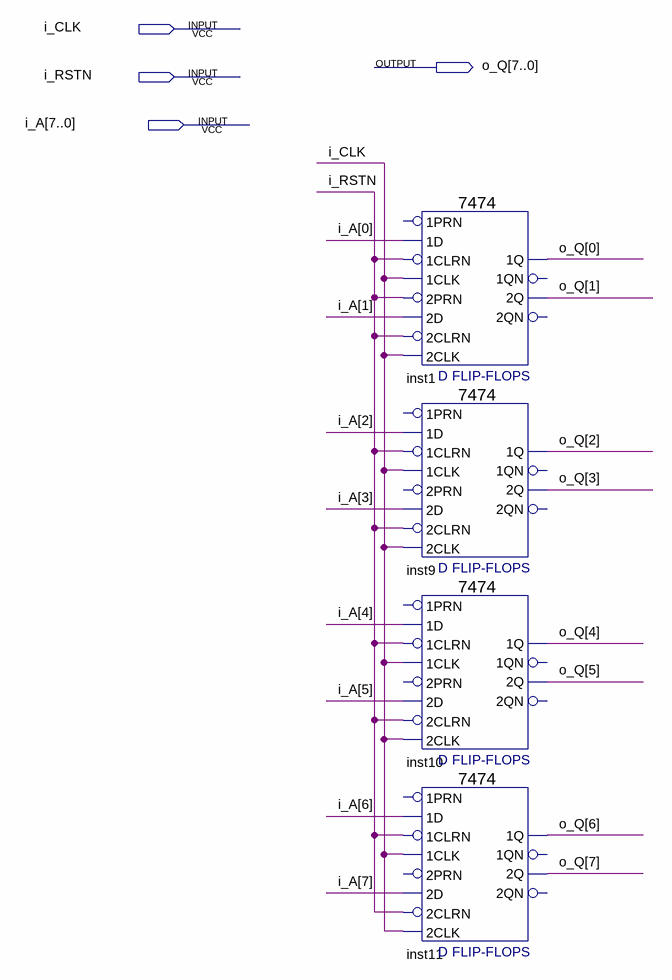
[diagram p0: schematic sheet]
// Quartus schematic dff_8bit.bdf as structural Verilog: 4 symbols, 4 pins
module dff_8bit (
  input  i_CLK,
  input  i_RSTN,
  input  [7:0] i_A,
  output [7:0] o_Q
);

  \7474  inst1 (
    .\2D (i_A[1]), .\2PRN (i_RSTN), .\1CLK (i_CLK), .\1D (i_A[0]), .\2CLK (i_CLK), .\2CLRN (i_RSTN),
    .\1CLRN (i_RSTN), .\2Q (o_Q[1]), .\1Q (o_Q[0]));  // open: 1PRN, 1QN, 2QN
  \7474  inst9 (
    .\2D (i_A[3]), .\1CLK (i_CLK), .\1D (i_A[2]), .\2CLK (i_CLK), .\2CLRN (i_RSTN), .\1CLRN (i_RSTN),
    .\2Q (o_Q[3]), .\1Q (o_Q[2]));  // open: 2PRN, 1PRN, 1QN, 2QN
  \7474  inst10 (
    .\2D (i_A[5]), .\1CLK (i_CLK), .\1D (i_A[4]), .\2CLK (i_CLK), .\2CLRN (i_RSTN), .\1CLRN (i_RSTN),
    .\2Q (o_Q[5]), .\1Q (o_Q[4]));  // open: 2PRN, 1PRN, 1QN, 2QN
  \7474  inst11 (
    .\2D (i_A[7]), .\1CLK (i_CLK), .\1D (i_A[6]), .\2CLK (i_CLK), .\2CLRN (i_RSTN), .\1CLRN (i_RSTN),
    .\2Q (o_Q[7]), .\1Q (o_Q[6]));  // open: 2PRN, 1PRN, 1QN, 2QN
endmodule
